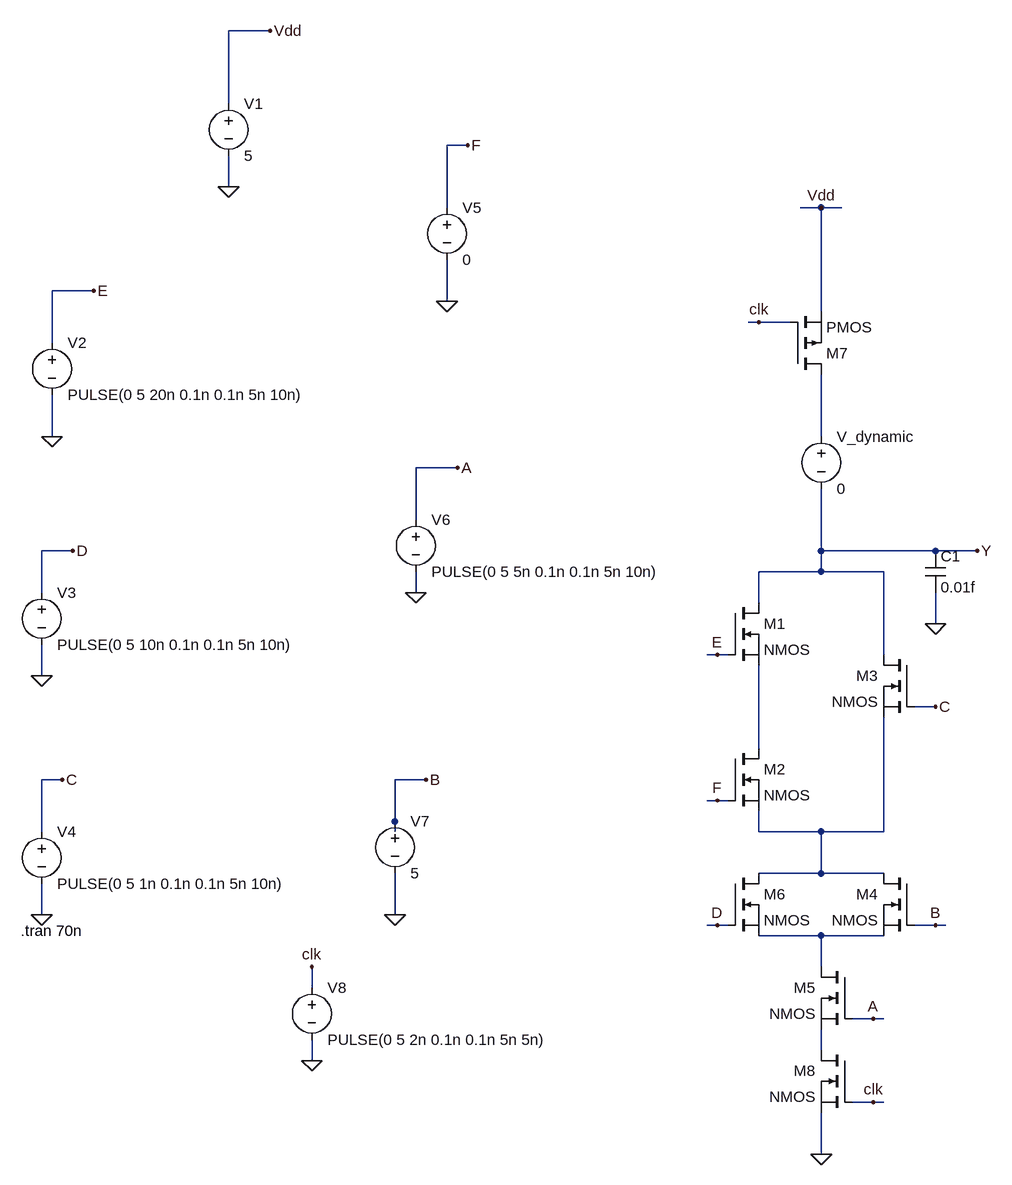
[diagram p0: schematic 5_2_3.asc]
5_2_3.asc, the LTspice schematic file:
Version 4
SHEET 1 1796 1140
WIRE -224 -608 -288 -608
WIRE -288 -496 -288 -608
WIRE 80 -432 48 -432
WIRE -288 -368 -288 -416
WIRE 48 -336 48 -432
WIRE 624 -336 592 -336
WIRE 656 -336 624 -336
WIRE -496 -208 -560 -208
WIRE 48 -192 48 -256
WIRE 624 -176 624 -336
WIRE 528 -160 512 -160
WIRE 576 -160 528 -160
WIRE -560 -128 -560 -208
WIRE -560 16 -560 -48
WIRE 624 16 624 -80
WIRE 64 64 0 64
WIRE 0 144 0 64
WIRE -528 192 -576 192
WIRE 624 192 624 96
WIRE 800 192 624 192
WIRE 864 192 800 192
WIRE 624 224 624 192
WIRE 624 224 528 224
WIRE 720 224 624 224
WIRE -576 256 -576 192
WIRE 0 256 0 224
WIRE 528 272 528 224
WIRE 800 304 800 256
WIRE 464 352 448 352
WIRE 480 352 464 352
WIRE 720 352 720 224
WIRE -576 384 -576 336
WIRE 800 432 768 432
WIRE 528 496 528 368
WIRE -544 544 -576 544
WIRE 16 544 -32 544
WIRE 464 576 448 576
WIRE 480 576 464 576
WIRE -32 608 -32 544
WIRE -576 624 -576 544
WIRE -32 624 -32 608
WIRE 528 624 528 592
WIRE 624 624 528 624
WIRE 720 624 720 448
WIRE 720 624 624 624
WIRE 624 688 624 624
WIRE 624 688 528 688
WIRE 720 688 624 688
WIRE -576 752 -576 704
WIRE -32 752 -32 688
WIRE 464 768 448 768
WIRE 480 768 464 768
WIRE 800 768 768 768
WIRE 816 768 800 768
WIRE 624 784 528 784
WIRE 720 784 624 784
WIRE 624 832 624 784
WIRE -160 864 -160 832
WIRE 704 912 672 912
WIRE 720 912 704 912
WIRE 624 960 624 928
WIRE -160 976 -160 944
WIRE 704 1040 672 1040
WIRE 720 1040 704 1040
WIRE 624 1120 624 1056
FLAG 864 192 Y
FLAG 624 -336 Vdd
FLAG -224 -608 Vdd
FLAG -288 -368 0
FLAG -496 -208 E
FLAG 80 -432 F
FLAG -528 192 D
FLAG 64 64 A
FLAG -544 544 C
FLAG 16 544 B
FLAG -576 752 0
FLAG -32 752 0
FLAG 0 256 0
FLAG -576 384 0
FLAG -560 16 0
FLAG 48 -192 0
FLAG 624 1120 0
FLAG 704 912 A
FLAG 800 768 B
FLAG 464 768 D
FLAG 800 432 C
FLAG 464 576 F
FLAG 464 352 E
FLAG -160 832 clk
FLAG -160 976 0
FLAG 704 1040 clk
FLAG 528 -160 clk
FLAG 800 304 0
SYMBOL nmos 480 272 R0
SYMATTR InstName M1
SYMBOL nmos 480 496 R0
SYMATTR InstName M2
SYMBOL nmos 768 352 M0
SYMATTR InstName M3
SYMBOL voltage -288 -512 R0
WINDOW 123 0 0 Left 0
WINDOW 39 0 0 Left 0
SYMATTR InstName V1
SYMATTR Value 5
SYMBOL voltage -560 -144 R0
WINDOW 123 0 0 Left 0
WINDOW 39 0 0 Left 0
SYMATTR InstName V2
SYMATTR Value PULSE(0 5 20n 0.1n 0.1n 5n 10n)
SYMBOL voltage -576 240 R0
WINDOW 123 0 0 Left 0
WINDOW 39 0 0 Left 0
SYMATTR InstName V3
SYMATTR Value PULSE(0 5 10n 0.1n 0.1n 5n 10n)
SYMBOL voltage -576 608 R0
WINDOW 123 0 0 Left 0
WINDOW 39 0 0 Left 0
SYMATTR InstName V4
SYMATTR Value PULSE(0 5 1n 0.1n 0.1n 5n 10n)
SYMBOL voltage 48 -352 R0
WINDOW 123 0 0 Left 0
WINDOW 39 0 0 Left 0
SYMATTR InstName V5
SYMATTR Value 0
SYMBOL voltage 0 128 R0
WINDOW 123 0 0 Left 0
WINDOW 39 0 0 Left 0
SYMATTR InstName V6
SYMATTR Value PULSE(0 5 5n 0.1n 0.1n 5n 10n)
SYMBOL voltage -32 592 R0
WINDOW 123 0 0 Left 0
WINDOW 39 0 0 Left 0
SYMATTR InstName V7
SYMATTR Value 5
SYMBOL nmos 768 688 M0
SYMATTR InstName M4
SYMBOL nmos 672 832 M0
SYMATTR InstName M5
SYMBOL nmos 480 688 R0
SYMATTR InstName M6
SYMBOL pmos 576 -80 M180
SYMATTR InstName M7
SYMBOL voltage 624 0 R0
SYMATTR InstName V_dynamic
SYMATTR Value 0
SYMBOL voltage -160 848 R0
WINDOW 123 0 0 Left 0
WINDOW 39 0 0 Left 0
SYMATTR InstName V8
SYMATTR Value PULSE(0 5 2n 0.1n 0.1n 5n 5n)
SYMBOL nmos 672 960 M0
SYMATTR InstName M8
SYMBOL cap 784 192 R0
SYMATTR InstName C1
SYMATTR Value 0.01f
TEXT -608 776 Left 2 !.tran 70n

The netlist it stands for:
* 5_2_3.asc
M1 Y E N002 N002 NMOS
M2 N002 F N003 N003 NMOS
M3 Y C N003 N003 NMOS
V1 Vdd 0 5
V2 E 0 PULSE(0 5 20n 0.1n 0.1n 5n 10n)
V3 D 0 PULSE(0 5 10n 0.1n 0.1n 5n 10n)
V4 C 0 PULSE(0 5 1n 0.1n 0.1n 5n 10n)
V5 F 0 0
V6 A 0 PULSE(0 5 5n 0.1n 0.1n 5n 10n)
V7 B 0 5
M4 N003 B N004 N004 NMOS
M5 N004 A N005 N005 NMOS
M6 N003 D N004 N004 NMOS
M7 N001 clk Vdd Vdd PMOS
V_dynamic N001 Y 0
V8 clk 0 PULSE(0 5 2n 0.1n 0.1n 5n 5n)
M8 N005 clk 0 0 NMOS
C1 Y 0 0.01f
.model NMOS NMOS
.model PMOS PMOS
.lib standard.mos
.tran 70n
.backanno
.end